# EAGLE design reflow (EAGLE 6.5.0)
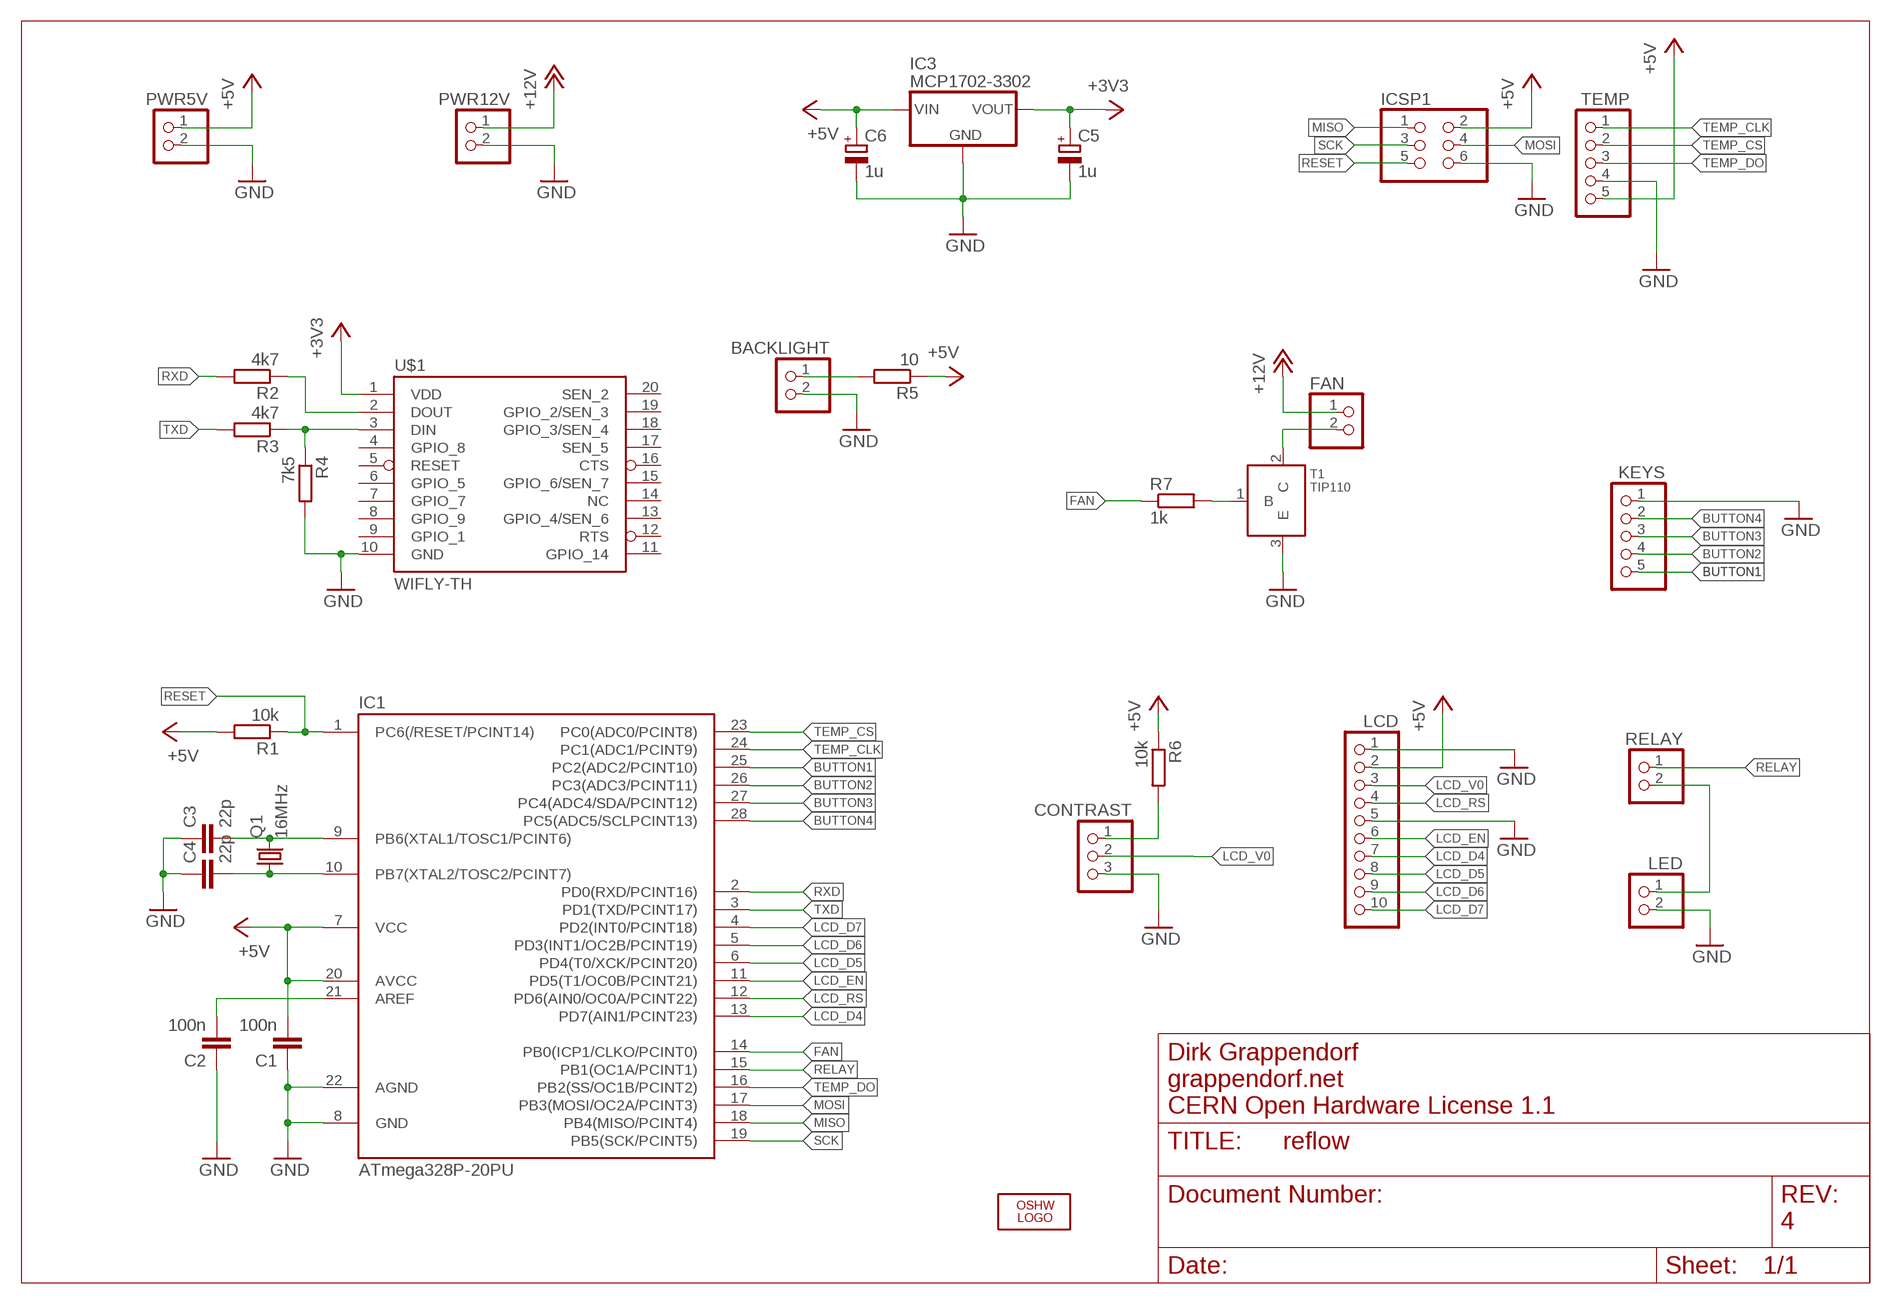
[diagram p0: schematic, sheet 1]

## Parts
BACKLIGHT  PINHD-1X2  [1X02]
C1  100n  C-EU025-024X044  [C025-024X044]
C2  100n  C-EU025-024X044  [C025-024X044]
C3  22p  C-EU025-025X050  [C025-025X050]
C4  22p  C-EU025-025X050  [C025-025X050]
C5  1u  CPOL-EUE2.5-5  [E2,5-5]
C6  1u  CPOL-EUE2.5-5  [E2,5-5]
CONTRAST  PINHD-1X3  [1X03]
FAN  PINHD-1X2  [1X02]
IC1  ATmega328P-20PU  ATMEGA48/88/168-PU  [DIL28-3]
IC3  MCP1702-3302  MCP1702  [MCP1702]
ICSP1  PINHD-2X03_2.54  [2X03]
KEYS  PINHD-1X5  [1X05]
LCD  PINHD-1X10  [1X10]
LED  PINHD-1X2  [1X02]
LOGO1  OSHW_LOGO_10MILX0350-NT-BOTTOM  [OSHW_10X350_NOTEXT_BOTTOM]
PWR5V  PINHD-1X2  [1X02]
PWR12V  PINHD-1X2  [1X02]
Q1  16MHz  CRYSTALHC49U-V  [HC49U-V]
R1  10k  R-EU_0204/7  [0204/7]
R2  4k7  R-EU_0204/7  [0204/7]
R3  4k7  R-EU_0204/7  [0204/7]
R4  7k5  R-EU_0204/7  [0204/7]
R5  10  R-EU_0204/7  [0204/7]
R6  10k  R-EU_0204/7  [0204/7]
R7  1k  R-EU_0204/7  [0204/7]
RELAY  PINHD-1X2  [1X02]
T1  TIP110  TIP112  [T0220]
TEMP  PINHD-1X5  [1X05]
U$1  WIFLY-TH  [WIFLY-TH]

## Nets
+3V3: C5.+ IC3.VOUT(OUT) U$1.1(VDD)
+5V: C1.2 C6.+ IC1.7(VCC) IC1.20(AVCC) IC3.VIN(IN) ICSP1.2 LCD.2 PWR5V.1 R1.2 R5.1 R6.1 TEMP.5
+12V: FAN.1 PWR12V.1
BUTTON1: IC1.25(PC2(ADC2/PCINT10)) KEYS.5
BUTTON2: IC1.26(PC3(ADC3/PCINT11)) KEYS.4
BUTTON3: IC1.27(PC4(ADC4/SDA/PCINT12)) KEYS.3
BUTTON4: IC1.28(PC5(ADC5/SCLPCINT13)) KEYS.2
FAN: IC1.14(PB0(ICP1/CLKO/PCINT0)) R7.1
GND: BACKLIGHT.2 C1.1 C2.1 C3.1 C4.1 C5.- C6.- CONTRAST.3 IC1.8(GND) IC1.22(AGND) IC3.GND ICSP1.6 KEYS.1 LCD.1 LCD.5 LED.2 PWR5V.2 PWR12V.2 R4.2 T1.3(E) TEMP.4 U$1.10(GND)
LCD_D4: IC1.13(PD7(AIN1/PCINT23)) LCD.7
LCD_D5: IC1.6(PD4(T0/XCK/PCINT20)) LCD.8
LCD_D6: IC1.5(PD3(INT1/OC2B/PCINT19)) LCD.9
LCD_D7: IC1.4(PD2(INT0/PCINT18)) LCD.10
LCD_EN: IC1.11(PD5(T1/OC0B/PCINT21)) LCD.6
LCD_RS: IC1.12(PD6(AIN0/OC0A/PCINT22)) LCD.4
LCD_V0: CONTRAST.2 LCD.3
MISO: IC1.18(PB4(MISO/PCINT4)) ICSP1.1
MOSI: IC1.17(PB3(MOSI/OC2A/PCINT3)) ICSP1.4
N$1: C3.2 IC1.9(PB6(XTAL1/TOSC1/PCINT6)) Q1.2
N$2: C4.2 IC1.10(PB7(XTAL2/TOSC2/PCINT7)) Q1.1
N$3: C2.2 IC1.21(AREF)
N$4: R3.1 R4.1 U$1.3(DIN)
N$5: R2.1 U$1.2(DOUT)
N$6: BACKLIGHT.1 R5.2
N$7: LED.1 RELAY.2
N$8: CONTRAST.1 R6.2
N$9: FAN.2 T1.2(C)
N$10: R7.2 T1.1(B)
RELAY: IC1.15(PB1(OC1A/PCINT1)) RELAY.1
RESET: IC1.1(PC6(/RESET/PCINT14)) ICSP1.5 R1.1
RXD: IC1.2(PD0(RXD/PCINT16)) R2.2
SCK: IC1.19(PB5(SCK/PCINT5)) ICSP1.3
TEMP_CLK: IC1.24(PC1(ADC1/PCINT9)) TEMP.1
TEMP_CS: IC1.23(PC0(ADC0/PCINT8)) TEMP.2
TEMP_DO: IC1.16(PB2(SS/OC1B/PCINT2)) TEMP.3
TXD: IC1.3(PD1(TXD/PCINT17)) R3.2
Unconnected: U$1.4(GPIO_8) U$1.5(RESET) U$1.6(GPIO_5) U$1.7(GPIO_7) U$1.8(GPIO_9) U$1.9(GPIO_1) U$1.11(GPIO_14) U$1.12(RTS) U$1.13(GPIO_4/SEN_6) U$1.14(NC) U$1.15(GPIO_6/SEN_7) U$1.16(CTS) U$1.17(SEN_5) U$1.18(GPIO_3/SEN_4) U$1.19(GPIO_2/SEN_3) U$1.20(SEN_2)

## Notes on the sheet
- Dirk Grappendorf
- grappendorf.net
- CERN Open Hardware License 1.1
- 4

## Library data of the parts
BACKLIGHT FAN LED PWR5V PWR12V RELAY = pinhead:PINHD-1X2: PIN HEADER
C1-C4 = rcl:C-EU: CAPACITOR, European symbol
C5 C6 = rcl:CPOL-EU: POLARIZED CAPACITOR, European symbol
CONTRAST = pinhead:PINHD-1X3: PIN HEADER
IC1 = atmega8:ATMEGA48/88/168-PU
IC3 = grapelabs:MCP1702: VOLTAGE REGULATOR
ICSP1 = pinhead-2:PINHD-2X03: PIN HEADER
KEYS TEMP = pinhead:PINHD-1X5: PIN HEADER
LCD = pinhead:PINHD-1X10: PIN HEADER
LOGO1 = OSHW:OSHW_LOGO_10MIL
Q1 = crystal:CRYSTAL: CRYSTAL
R1-R7 = rcl:R-EU_: RESISTOR, European symbol
T1 = tip112:TIP112
U$1 = grapelabs:WIFLY

## Net classes
0 default: width 0.254 mm, drill 0.305 mm, clearance 0.152 mm
1 power: width 0.61 mm, drill 0.508 mm, clearance 0.152 mm
2 gnd: width 0.305 mm, drill 0.508 mm, clearance 0.152 mm
3 usbvcc: width 0.508 mm, drill 0.508 mm, clearance 0.152 mm
4 aref: width 0.406 mm

## Board
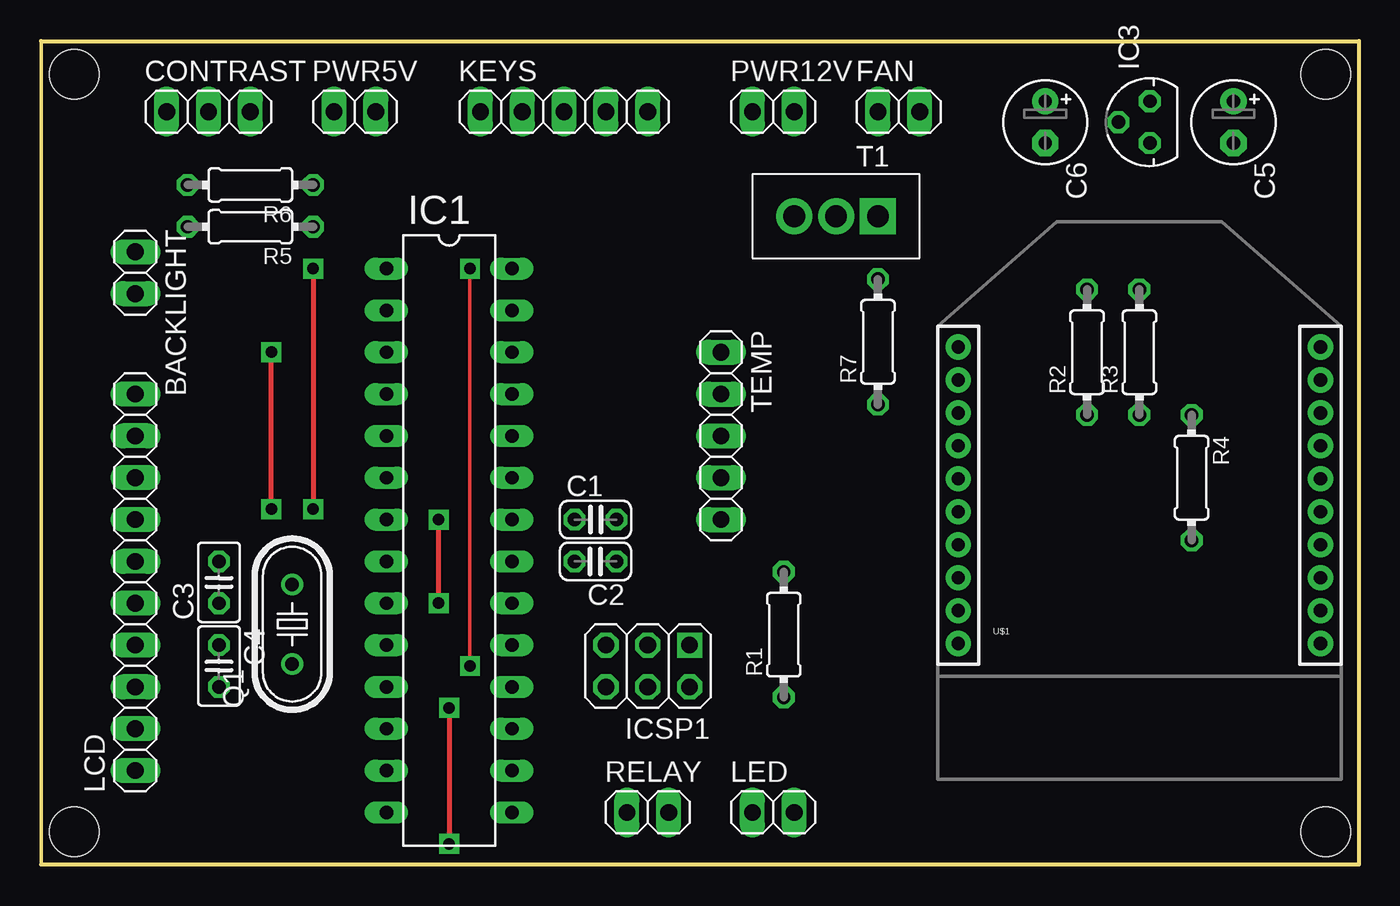
[diagram p1: board, top side]
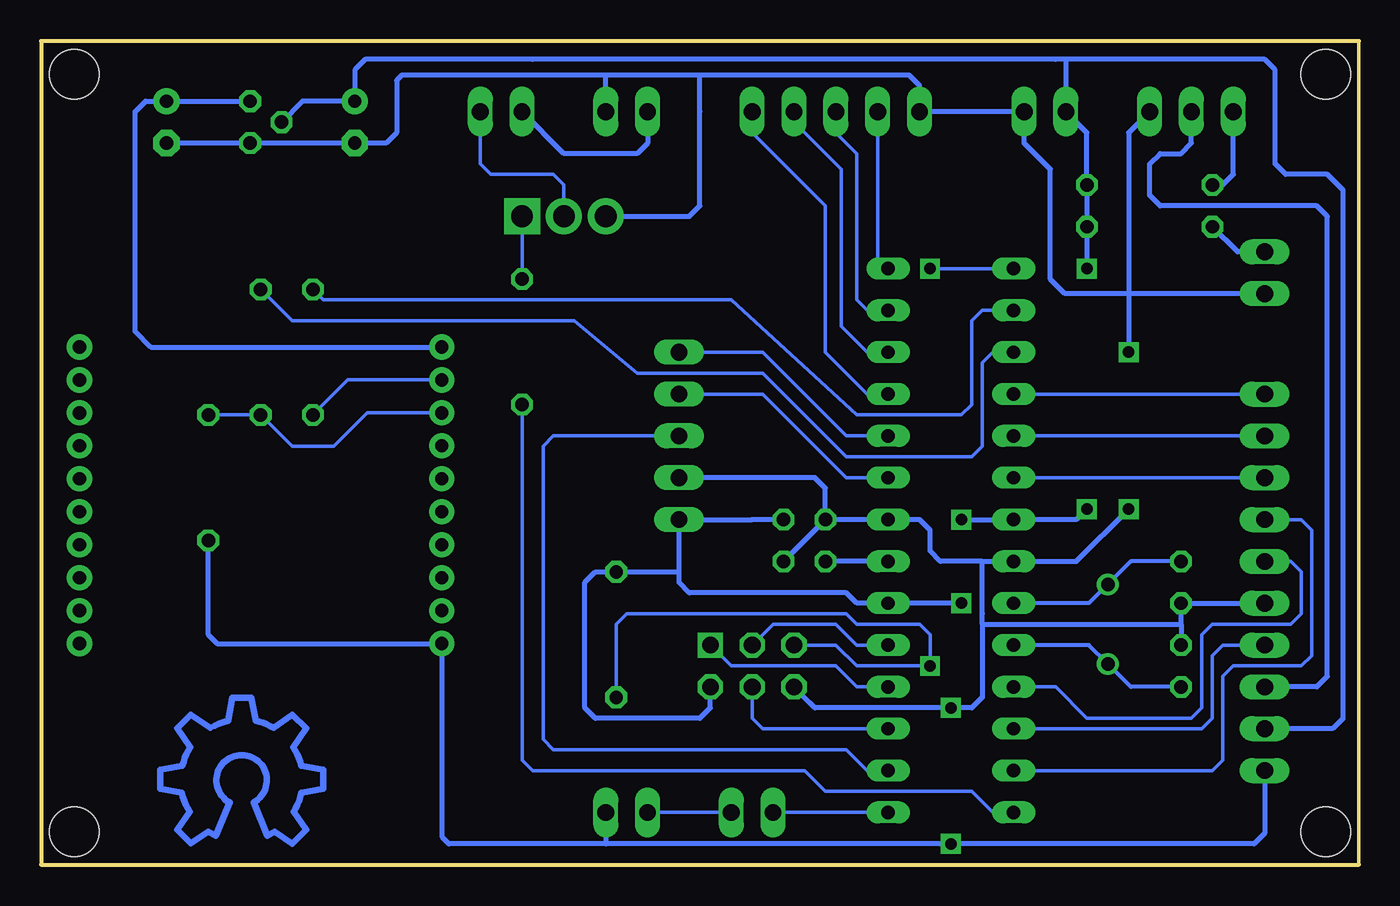
[diagram p2: board, bottom side, seen from below]

Size 80 x 50 mm. Coordinates in mm from the lower left corner, seen from the top.
Outline: 0,50 80,50 80,0 0,0 0,50
Copper layers (1*16): Top 0.035mm / dielectric 1.5mm / Bottom 0.035mm
Design rules "default *": minimum track width 6mil, minimum drill 12mil, track to track 6mil, track to pad 6mil, pad to pad 6mil, via to via 6mil, smd to smd 6mil, copper to edge 30mil, drill to drill 6mil, minimum pad ring 10mil, minimum via ring 10mil, stop-mask expansion 4mil, vias tented up to drill 0mil, thermal gap 10mil
Holes 3 mm at 2,48 2,2 78,48 78,2

### Footprints (pad centres in the part's own frame; a part is rotated, then mirrored left to right if it is on the bottom)
1X02 = drill 1.016 long: 1 -1.27,0; 2 1.27,0
C025-024X044 = drill 0.813 octagon: 1 -1.27,0; 2 1.27,0
C025-025X050 = drill 0.813 octagon: 1 -1.27,0; 2 1.27,0
E2,5-5 = drill 0.813 pad 1.6: + -1.27,0 | drill 0.813 pad 1.6 octagon: - 1.27,0
1X03 = drill 1.016 long: 1 -2.54,0; 2 0,0; 3 2.54,0
DIL28-3 = drill 0.813 long: 1 -16.51,-3.81; 2 -13.97,-3.81; 3 -11.43,-3.81; 4 -8.89,-3.81; 5 -6.35,-3.81; 6 -3.81,-3.81; 7 -1.27,-3.81; 8 1.27,-3.81; 9 3.81,-3.81; 10 6.35,-3.81; 11 8.89,-3.81; 12 11.43,-3.81; 13 13.97,-3.81; 14 16.51,-3.81; 15 16.51,3.81; 16 13.97,3.81; 17 11.43,3.81; 18 8.89,3.81; 19 6.35,3.81; 20 3.81,3.81; 21 1.27,3.81; 22 -1.27,3.81; 23 -3.81,3.81; 24 -6.35,3.81; 25 -8.89,3.81; 26 -11.43,3.81; 27 -13.97,3.81; 28 -16.51,3.81
MCP1702 = drill 0.813 octagon: GND -1.27,0; VIN 0,1.905; VOUT 1.27,0
2X03 = drill 1.016 square: 1 -2.54,-1.27 | drill 1.016 octagon: 2 -2.54,1.27; 3 0,-1.27; 4 0,1.27; 5 2.54,-1.27; 6 2.54,1.27
1X05 = drill 1.016 long: 1 -5.08,0; 2 -2.54,0; 3 0,0; 4 2.54,0; 5 5.08,0
1X10 = drill 1.016 long: 1 -11.43,0; 2 -8.89,0; 3 -6.35,0; 4 -3.81,0; 5 -1.27,0; 6 1.27,0; 7 3.81,0; 8 6.35,0; 9 8.89,0; 10 11.43,0
HC49U-V = drill 0.813: 1 -2.413,0; 2 2.413,0
0204/7 = drill 0.813 octagon: 1 -3.81,0; 2 3.81,0
T0220 = drill 1.321 pad 2.184 square: 1 0,0 | drill 1.321 pad 2.184: 2 2.54,0; 3 5.08,0
WIFLY-TH = drill 0.8 pad 1.524: 1 -11,20; 2 -11,18; 3 -11,16; 4 -11,14; 5 -11,12; 6 -11,10; 7 -11,8; 8 -11,6; 9 -11,4; 10 -11,2; 11 11,2; 12 11,4; 13 11,6; 14 11,8; 15 11,10; 16 11,12; 17 11,14; 18 11,16; 19 11,18; 20 11,20

### Placement (x,y rotation side)
BACKLIGHT  5.71,35.94 270 top
C1  33.66,20.95 0 top
C2  33.66,18.41 180 top
C3  10.79,17.14 90 top
C4  10.79,12.06 270 top
C5  72.39,45.09 270 top
C6  60.96,45.09 270 top
CONTRAST  10.16,45.72 0 top
FAN  52.07,45.72 0 top
IC1  24.77,19.68 270 top
IC3  67.31,45.09 90 top
ICSP1  36.83,12.06 180 top
KEYS  31.75,45.72 0 top
LCD  5.71,17.14 90 top
LED  44.45,3.17 0 top
LOGO1  67.94,5.08 0 top
PWR5V  19.05,45.72 0 top
PWR12V  44.45,45.72 0 top
Q1  15.24,14.61 90 top
R1  45.09,13.97 90 top
R2  63.5,31.11 90 top
R3  66.67,31.11 90 top
R4  69.85,23.5 270 top
R5  12.7,38.73 180 top
R6  12.7,41.27 180 top
R7  50.8,31.75 90 top
RELAY  36.83,3.17 0 top
T1  50.8,39.37 180 top
TEMP  41.27,26.04 270 top
U$1  66.67,11.43 0 top

### Tracks (layer width: path | path; a pad name or v marks a point on that pad's centre or on a via)
+3V3
  Bottom 0.305: IC3.VOUT C5.+ 73.66,46.35 74.3,45.72 74.3,32.38 73.34,31.43 U$1.1
+5V  (via drill 0.7)
  Top 0.305: v24.13,15.88 v24.13,20.95 | v16.51,36.2 v16.51,21.59
  Bottom 0.305: v24.13,20.95 IC1.7 17.14,20.95 v16.51,21.59 | v24.13,15.88 IC1.20 30.48,15.88 31.11,16.51 40.64,16.51 41.27,17.14 41.27,17.78 | IC3.VIN 64.14,46.35 C6.+ 60.96,48.26 60.33,48.9 50.16,48.9 18.41,48.9 17.78,48.9 | LCD.2 1.59,8.26 0.95,8.89 0.95,40.96 1.91,41.91 4.45,41.91 5.08,42.55 5.08,48.26 5.71,48.9 17.78,48.9 | 17.78,48.9 PWR5V.1 16.51,44.45 R6.1 R5.1 v16.51,36.2 | ICSP1.2 39.37,9.53 40.01,8.89 46.35,8.89 46.99,9.53 46.99,17.14 46.35,17.78 R1.2 41.27,17.78 | C1.2 36.83,20.95 TEMP.5 41.27,17.78
+12V
  Bottom 0.305: PWR12V.1 43.18,43.81 43.81,43.18 48.26,43.18 FAN.1
BUTTON1
  Bottom 0.203: KEYS.5 36.83,44.45 32.38,40.01 32.38,31.11 29.84,28.57 IC1.25
BUTTON2
  Bottom 0.203: IC1.26 29.84,31.11 31.43,32.7 31.43,42.23 34.29,45.09 KEYS.4
BUTTON3
  Bottom 0.203: KEYS.3 31.75,44.45 30.48,43.18 30.48,34.29 29.84,33.66 IC1.27
BUTTON4
  Bottom 0.203: KEYS.2 29.21,36.83 IC1.28
FAN
  Bottom 0.203: IC1.14 22.23,3.17 23.5,4.45 32.38,4.45 33.66,5.71 50.16,5.71 50.8,6.35 R7.1
GND  (via drill 0.7)
  Top 0.305: v13.97,21.59 v13.97,31.11 | v24.77,9.53 v24.77,1.27
  Bottom 0.305: 10.79,14.61 C4.1 | 10.79,14.61 C3.1 LCD.5 | 22.86,18.41 25.4,18.41 26.04,19.05 26.04,20.32 26.67,20.95 IC1.22 C1.1 | 22.86,18.41 IC1.8 17.14,18.41 v13.97,21.59 | 22.86,18.41 22.86,15.24 22.86,14.61 | 22.86,14.61 10.79,14.61 | C1.1 C2.1 | C5.- IC3.GND C6.- 59.05,43.81 58.42,44.45 58.42,47.62 58.1,47.94 45.72,47.94 | R4.2 69.85,13.97 69.31,13.43 U$1.10 55.67,1.7 55.24,1.27 45.72,1.27 | CONTRAST.3 13.97,44.45 13.97,34.61 | 33.02,9.53 33.34,9.84 | 33.34,9.84 ICSP1.6 | C1.1 32.38,22.86 33.02,23.5 TEMP.4 | LCD.1 5.71,1.91 6.35,1.27 v24.77,1.27 | v24.77,1.27 25.4,1.27 | 25.4,1.27 45.72,1.27 | LED.2 45.72,1.27 | 22.86,14.61 22.86,10.16 23.5,9.53 v24.77,9.53 33.02,9.53 | 33.02,9.53 33.34,9.84 | 40.01,47.94 27.3,47.94 26.67,47.31 KEYS.1 PWR5V.2 20.32,43.81 18.73,42.23 18.73,35.56 17.84,34.67 13.91,34.67 | 40.01,47.94 45.72,47.94 | 13.97,34.61 v13.97,31.11 | BACKLIGHT.2 13.91,34.67 | 13.91,34.67 13.97,34.61 | T1.3 40.64,39.37 40.01,40.01 40.01,45.72 40.01,47.94 | v24.77,1.27 25.4,1.27 | PWR12V.2 45.72,47.94
LCD_D4
  Bottom 0.203: LCD.7 3.49,20.95 2.86,20.32 2.86,12.7 3.49,12.06 7.62,12.06 8.26,11.43 8.26,6.35 8.89,5.71 IC1.13
LCD_D5
  Bottom 0.203: LCD.8 IC1.6
LCD_D6
  Bottom 0.203: LCD.9 IC1.5
LCD_D7
  Bottom 0.203: LCD.10 IC1.4
LCD_EN
  Bottom 0.203: LCD.6 4.13,18.41 3.49,17.78 3.49,15.24 4.13,14.61 8.89,14.61 9.53,13.97 9.53,9.53 10.16,8.89 16.51,8.89 18.41,10.79 IC1.11
LCD_RS
  Bottom 0.203: LCD.4 8.26,13.34 8.89,12.7 8.89,8.89 9.53,8.26 IC1.12
LCD_V0
  Bottom 0.305: LCD.3 2.54,10.79 1.91,11.43 1.91,39.37 2.54,40.01 12.06,40.01 12.7,40.64 12.7,42.55 12.06,43.18 10.79,43.18 10.16,43.81 CONTRAST.2
MISO
  Bottom 0.203: ICSP1.1 38.1,12.06 31.75,12.06 30.48,10.79 IC1.18
MOSI
  Bottom 0.203: IC1.17 36.2,8.26 36.83,8.89 ICSP1.4
N$1
  Bottom 0.254: IC1.9 16.38,15.88 Q1.2 13.84,18.41 C3.2
N$2
  Bottom 0.254: IC1.10 16.38,13.34 Q1.1 13.84,10.79 C4.2
N$3
  Bottom 0.305: IC1.21 C2.2
N$4
  Bottom 0.203: R4.1 R3.1 64.77,25.4 62.23,25.4 60.2,27.43 U$1.3
N$5
  Bottom 0.203: R2.1 61.38,29.43 U$1.2
N$6
  Bottom 0.305: BACKLIGHT.1 7.37,37.21 R5.2
N$7
  Bottom 0.203: RELAY.2 LED.1
N$8
  Bottom 0.305: CONTRAST.1 7.62,41.91 8.26,41.27 R6.2
N$9
  Bottom 0.203: FAN.2 53.34,42.55 52.7,41.91 48.9,41.91 48.26,41.27 T1.2
N$10
  Bottom 0.203: T1.1 R7.2
RELAY
  Bottom 0.203: IC1.15 RELAY.1
RESET  (via drill 0.7)
  Top 0.203: v26.04,12.06 v26.04,36.2
  Bottom 0.203: v26.04,36.2 IC1.1 | ICSP1.5 31.75,13.34 30.48,12.06 v26.04,12.06 26.04,13.97 26.67,14.61 30.48,14.61 31.11,15.24 44.45,15.24 45.09,14.61 R1.1
RXD
  Bottom 0.203: IC1.2 22.86,33.66 23.5,33.02 23.5,27.94 24.13,27.3 30.48,27.3 38.1,34.29 62.87,34.29 R2.2
SCK
  Bottom 0.203: ICSP1.3 35.56,14.61 31.75,14.61 30.48,13.34 IC1.19
TEMP_CLK
  Bottom 0.203: IC1.24 31.11,26.04 36.2,31.11 TEMP.1
TEMP_CS
  Bottom 0.203: IC1.23 31.11,23.5 36.2,28.57 TEMP.2
TEMP_DO
  Bottom 0.203: IC1.16 29.84,5.71 31.11,6.99 48.9,6.99 49.53,7.62 49.53,25.4 48.9,26.04 TEMP.3
TXD
  Bottom 0.203: IC1.3 22.23,31.11 22.86,30.48 22.86,25.4 23.5,24.77 31.11,24.77 36.2,29.84 43.81,29.84 47.62,33.02 64.77,33.02 R3.2